# Altium schematic sheet 02.SchDoc
size 297 x 209 mm
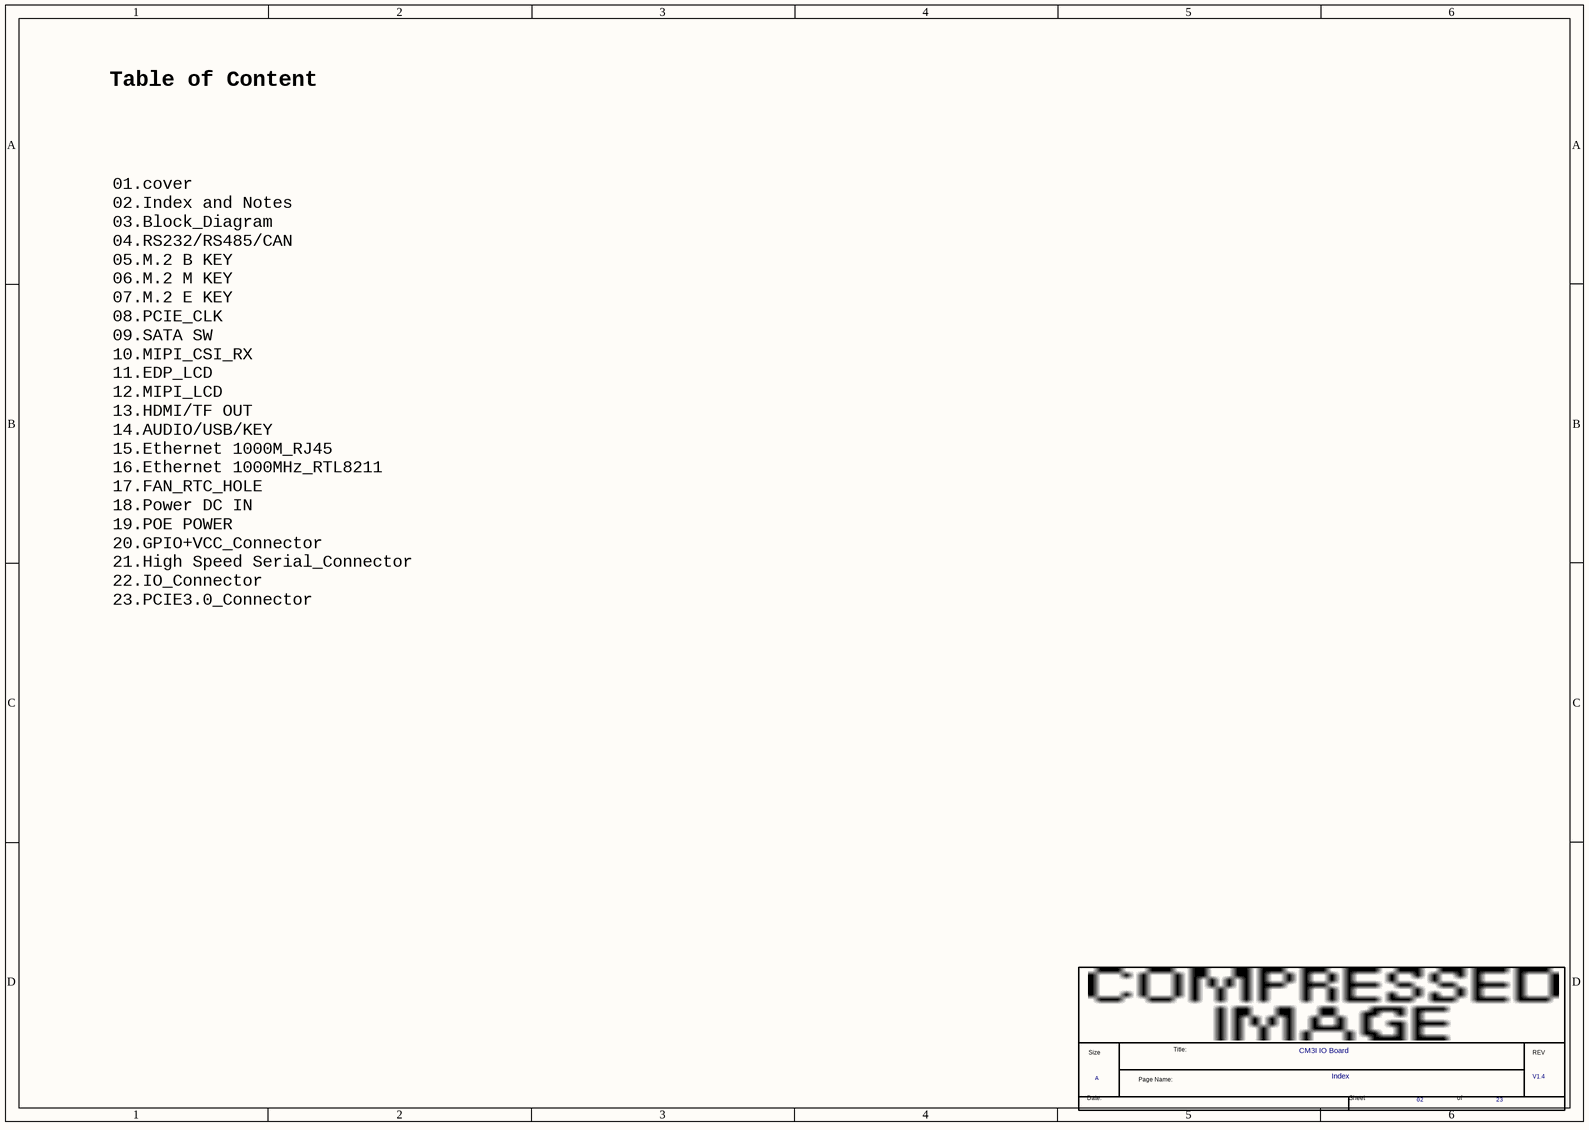
[diagram p0: 02.SchDoc]

## Parts
*  Page Count: 23  Page Number: 02  Page Size: A  Title: CM3I IO Board  RevCode: V1.4  Doc: Index  (hidden comment: radxa_1010)  (graphical)

## Notes on the sheet
- Table of Content
- 01.cover
  02.Index and Notes
  03.Block_Diagram
  04.RS232/RS485/CAN
  05.M.2 B KEY
  06.M.2 M KEY
  07.M.2 E KEY
  08.PCIE_CLK
  09.SATA SW
  10.MIPI_CSI_RX
  11.EDP_LCD
  12.MIPI_LCD
  13.HDMI/TF OUT
  14.AUDIO/USB/KEY
  15.Ethernet 1000M_RJ45
  16.Ethernet 1000MHz_RTL8211
  17.FAN_RTC_HOLE
  18.Power DC IN
  19.POE POWER
  20.GPIO+VCC_Connector
  21.High Speed Serial_Connector
  22.IO_Connector
  23.PCIE3.0_Connector
- (in symbol radxa_1010) Title:; Size; REV; Page Name:; Date:; Sheet; of

## Library data of the parts
* = radxa_1010: Page Create Date: March  8, 1995